# Altium schematic sheet GSM Communication Signals.SchDoc: GSM Communication Signals
size A3
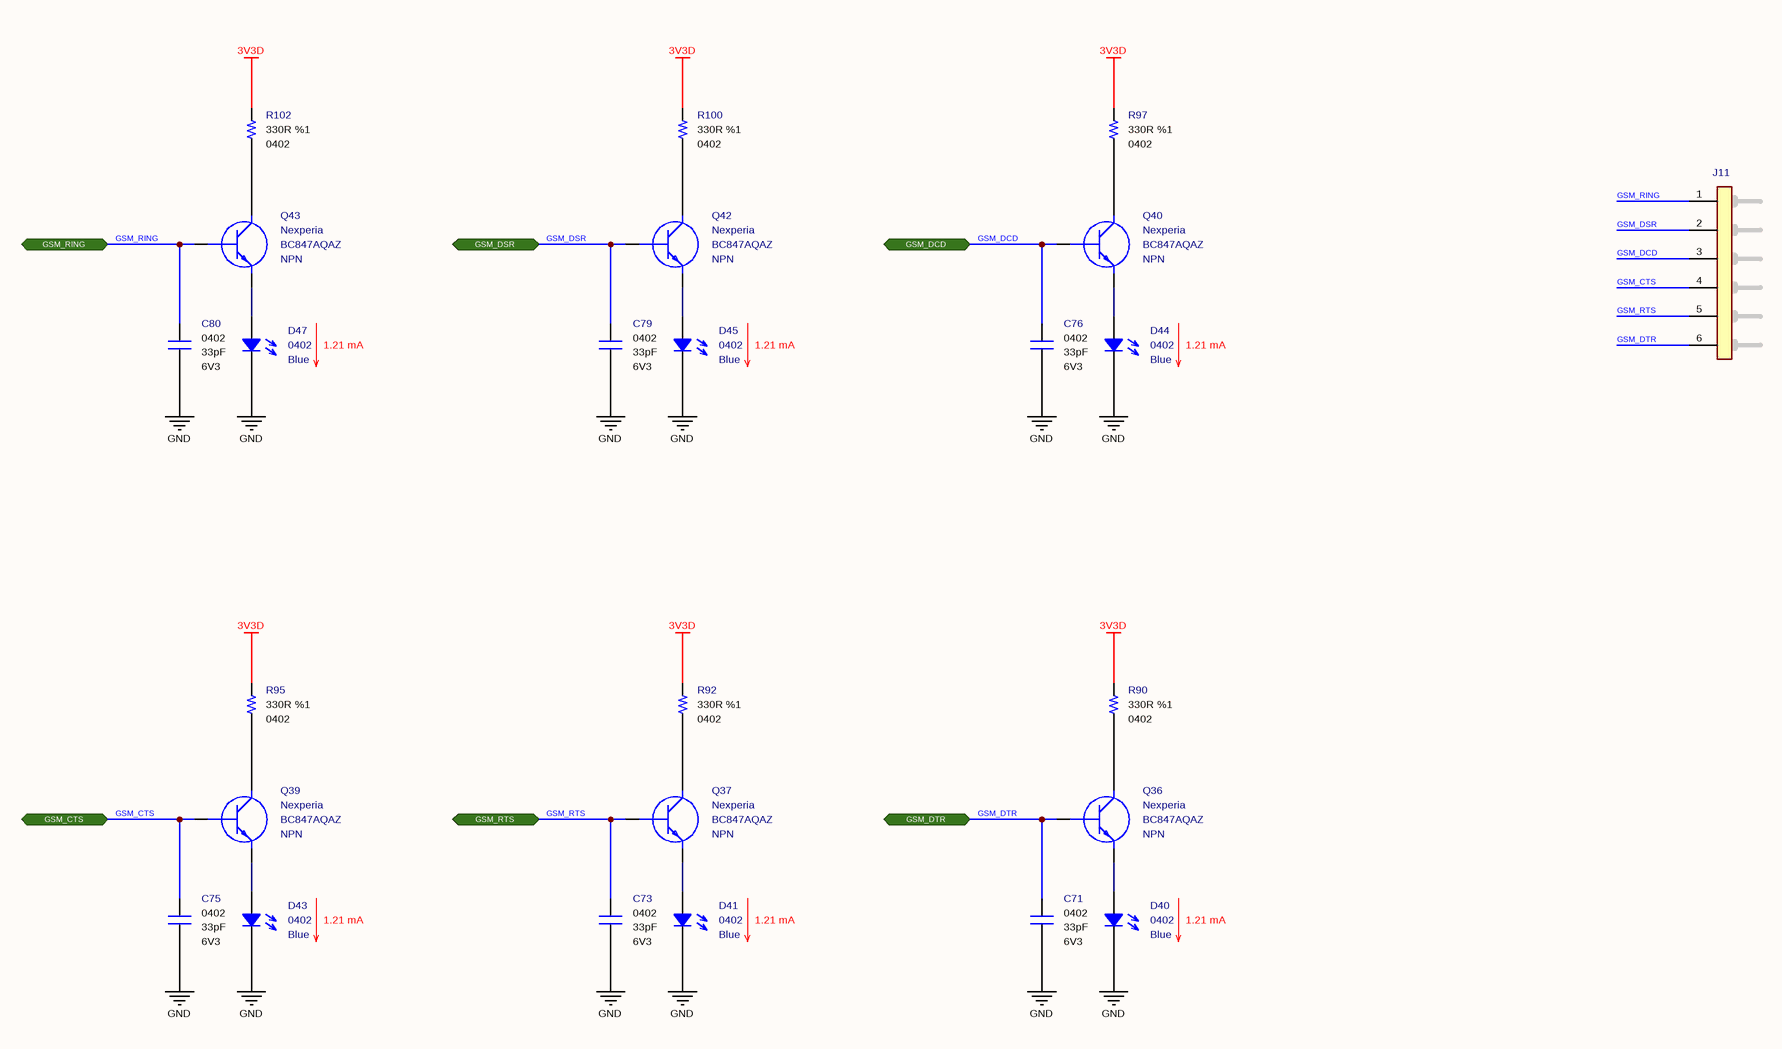
[diagram p0: GSM Communication Signals.SchDoc]

## Parts
C71  value 33pF  Case: 0402  Voltage: 6V3  [CAPACITOR_0402]  (hidden comment: Multilayer Ceramic Capacitor)
C73  value 33pF  Case: 0402  Voltage: 6V3  [CAPACITOR_0402]  (hidden comment: Multilayer Ceramic Capacitor)
C75  value 33pF  Case: 0402  Voltage: 6V3  [CAPACITOR_0402]  (hidden comment: Multilayer Ceramic Capacitor)
C76  value 33pF  Case: 0402  Voltage: 6V3  [CAPACITOR_0402]  (hidden comment: Multilayer Ceramic Capacitor)
C79  value 33pF  Case: 0402  Voltage: 6V3  [CAPACITOR_0402]  (hidden comment: Multilayer Ceramic Capacitor)
C80  value 33pF  Case: 0402  Voltage: 6V3  [CAPACITOR_0402]  (hidden comment: Multilayer Ceramic Capacitor)
D40  Case: 0402  Color: Blue  [LED_0402]  (hidden comment: SMD LED (Blue))
D41  Case: 0402  Color: Blue  [LED_0402]  (hidden comment: SMD LED (Blue))
D43  Case: 0402  Color: Blue  [LED_0402]  (hidden comment: SMD LED (Blue))
D44  Case: 0402  Color: Blue  [LED_0402]  (hidden comment: SMD LED (Blue))
D45  Case: 0402  Color: Blue  [LED_0402]  (hidden comment: SMD LED (Blue))
D47  Case: 0402  Color: Blue  [LED_0402]  (hidden comment: SMD LED (Blue))
J11  2.54 mm Pitch 6P Male Connector  [6P Header]  (value not drawn)
Q36  Manufacturer_Name: Nexperia  Manufacturer_Part_Number: BC847AQAZ  Polarity: NPN  [SOT1215]  (hidden comment: Bipolar NPN Transistors)
Q37  Manufacturer_Name: Nexperia  Manufacturer_Part_Number: BC847AQAZ  Polarity: NPN  [SOT1215]  (hidden comment: Bipolar NPN Transistors)
Q39  Manufacturer_Name: Nexperia  Manufacturer_Part_Number: BC847AQAZ  Polarity: NPN  [SOT1215]  (hidden comment: Bipolar NPN Transistors)
Q40  Manufacturer_Name: Nexperia  Manufacturer_Part_Number: BC847AQAZ  Polarity: NPN  [SOT1215]  (hidden comment: Bipolar NPN Transistors)
Q42  Manufacturer_Name: Nexperia  Manufacturer_Part_Number: BC847AQAZ  Polarity: NPN  [SOT1215]  (hidden comment: Bipolar NPN Transistors)
Q43  Manufacturer_Name: Nexperia  Manufacturer_Part_Number: BC847AQAZ  Polarity: NPN  [SOT1215]  (hidden comment: Bipolar NPN Transistors)
R90  value 330R  Tolerance: %1  Case: 0402  [RESISTOR_0402]  (hidden comment: Thick Film Resistor)
R92  value 330R  Tolerance: %1  Case: 0402  [RESISTOR_0402]  (hidden comment: Thick Film Resistor)
R95  value 330R  Tolerance: %1  Case: 0402  [RESISTOR_0402]  (hidden comment: Thick Film Resistor)
R97  value 330R  Tolerance: %1  Case: 0402  [RESISTOR_0402]  (hidden comment: Thick Film Resistor)
R100  value 330R  Tolerance: %1  Case: 0402  [RESISTOR_0402]  (hidden comment: Thick Film Resistor)
R102  value 330R  Tolerance: %1  Case: 0402  [RESISTOR_0402]  (hidden comment: Thick Film Resistor)

## Ports
GSM_CTS (bidir), GSM_DCD (bidir), GSM_DSR (bidir), GSM_DTR (bidir), GSM_RING (bidir), GSM_RTS (bidir)

## Nets
3V3D: R90.2 R92.2 R95.2 R97.2 R100.2 R102.2
GND: C71.2 C73.2 C75.2 C76.2 C79.2 C80.2 D40.1 D41.1 D43.1 D44.1 D45.1 D47.1
GSM_CTS: C75.1 J11.4(Pin-4) Q39.1(B) ; port GSM_CTS
GSM_DCD: C76.1 J11.3(Pin-3) Q40.1(B) ; port GSM_DCD
GSM_DSR: C79.1 J11.2(Pin-2) Q42.1(B) ; port GSM_DSR
GSM_DTR: C71.1 J11.6(Pin-6) Q36.1(B) ; port GSM_DTR
GSM_RING: C80.1 J11.1(Pin-1) Q43.1(B) ; port GSM_RING
GSM_RTS: C73.1 J11.5(Pin-5) Q37.1(B) ; port GSM_RTS
NetD40_2: D40.2 Q36.2(E)
NetD41_2: D41.2 Q37.2(E)
NetD43_2: D43.2 Q39.2(E)
NetD44_2: D44.2 Q40.2(E)
NetD45_2: D45.2 Q42.2(E)
NetD47_2: D47.2 Q43.2(E)
NetQ36_3: Q36.3(C) R90.1
NetQ37_3: Q37.3(C) R92.1
NetQ39_3: Q39.3(C) R95.1
NetQ40_3: Q40.3(C) R97.1
NetQ42_3: Q42.3(C) R100.1
NetQ43_3: Q43.3(C) R102.1

## Notes on the sheet
- 1.21 mA
- Title
- Size:
- Date:
- A3
- Number:
- Time:
- Revision:
- Sheet
- of
- File:

## Library data of the parts
C71 C73 C75 C76 C79 C80 = Capacitor - 33pF [0402-6V3]: Capacitor - 33pF [0402] (Ceramic); Manufacturer Name: Kemet; Manufacturer Part Number: C0402C330J9RACAUTO; Dielectric: X7R; Tolerance: 10%; Height: 0.5mm; Maximum Operating Temperature: +125; Minimum Operating Temperature: -55; ROHS: Yes; ComponentLink1Description: DataSheet; ComponentLink1URL: https://api.kemet.com/component-edge/download/datasheet/C0402C330J9RACAUTO.pdf; ComponentLink2Description: Mouser; ComponentLink2URL: https://www.mouser.com/Search/Refine.aspx?Keyword=80-C0402C330J9RAUTO; Supplier 1: Mouser; Supplier Part Number 1: 80-C0402C330J9RAUTO; Mouser Part Number: 80-C0402C330J9RAUTO
D40 D41 D43-D45 D47 = Diode - LED (0402-Blue): Standard LEDs - SMD PICOLEDTM;BLUE LED; 25M @ 5MA; Manufacturer_Name: ROHM Semiconductor; Manufacturer_Part_Number: SMLP13BC8TT86; Mouser_Part_Number: 755-SMLP13BC8TT86; ROHS: Yes; ComponentLink1Description: DataSheet; ComponentLink1URL: https://d1d2qsbl8m0m72.cloudfront.net/en/products/databook/datasheet/opto/led/chip_mono/sml-p1-e.pdf; ComponentLink2Description: Mouser; ComponentLink2URL: https://www.mouser.com.tr/ProductDetail/ROHM-Semiconductor/SMLP13BC8TT86?qs=%2Fha2pyFaduidYDgXFKL%252BNZwCVZNUI4FlyPWWbVDx1b6ABmzS%252BS2f0w%3D%3D; Supplier 1: Mouser; Supplier 2: Digi-Key; Supplier Part Number 1: 755-SMLP13BC8TT86; Supplier Part Number 2: 846-1112-1-ND
J11 = Connector - Male Header 6P (2.54): Headers & Wire Housings BREAKAWAY HDR VERT 6; Manufacturer Name: Molex; Position: 6; Row: 1; Pitch: 2.54 mm; Manufacturer Part Number: 22-28-4063; Mouser Part Number: 538-22-28-4063; ROHS: Yes; ComponentLink1Description: DataSheet; ComponentLink1URL: https://www.mouser.com.tr/datasheet/2/276/0022284063_PCB_HEADERS-228265.pdf; ComponentLink2Description: Mouser; ComponentLink2URL: https://www.mouser.com.tr/ProductDetail/Molex/22-28-4063?qs=sGAEpiMZZMs%252BGHln7q6pm%252BS0pk2Wo0XxVjxVgqsrZJ8%3D; Supplier 1: Mouser; Supplier 2: Digi-Key; Supplier Part Number 2: WM50016-06-ND; Supplier Part Number 1: 538-22-28-4063
Q36 Q37 Q39 Q40 Q42 Q43 = Transistor - BC847: Bipolar Transistors - BJT BC847AQA/DFN1010D-3/REEL 7" Q2; Mouser_Part_Number: 771-BC847AQAZ; ComponentLink1Description: DataSheet; ComponentLink1URL: https://www.mouser.com.tr/datasheet/2/916/BC847XQA_SER-1598405.pdf; ComponentLink2Description: Mouser; ComponentLink2URL: https://www.mouser.com.tr/ProductDetail/Nexperia/BC847AQAZ?qs=%2Fha2pyFaduhKMCPKNtQimeJpXTw9z4AqURd2YARs8DVICZNv3AT9Dw%3D%3D; Case: DFN-1010D-3; Supplier 1: Mouser; Supplier 2: Digi-Key; Supplier Part Number 1: 771-BC847AQAZ; Supplier Part Number 2: 1727-2545-1-ND
R90 R92 R95 R97 R100 R102 = Resistor - 330R: Thick Film Resistors - SMD 1/16 W 330 Ohm 1%; Manufacturer Name: Vishay; Manufacturer Part Number: CRCW0402330RFKED; Height: 0.4mm; ComponentLink1Description: DataSheet; ComponentLink1URL: https://www.mouser.com.tr/datasheet/2/427/dcrcwe3-1762152.pdf; ComponentLink2Description: Mouser; ComponentLink2URL: https://www.mouser.com.tr/ProductDetail/Vishay-Dale/CRCW0402330RFKED?qs=sGAEpiMZZMu61qfTUdNhG2DpbjADlD3GGS6SwBlLi5Q%3D; Supplier 1: Mouser; Supplier 2: Digi-Key; Supplier Part Number 2: 541-330LCT-ND; Supplier Part Number 1: 71-CRCW0402-330-E3; Mouser Part Number: 71-CRCW0402-330-E3